# Altium schematic sheet System.SchDoc
size A4
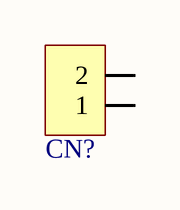
[diagram p0: System.SchDoc]

## Parts
CN?  24VIN  [WJ128V-2P]  (value not drawn)

## Nets

Not connected (* = marked no-connect by the designer): CN? 1 2

## Library data of the parts
CN? = CON2: 连接器; 松下: B2PVHB